# Altium project aqua-pcb.PrjPcb
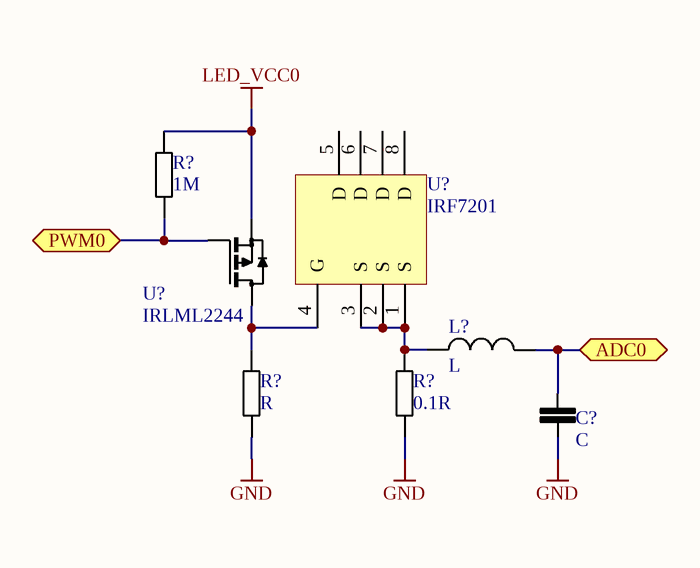
[diagram p0: dimmer.SchDoc]
1 sheet, 7 parts. Net scope: flat (ports and power ports of the same name join across sheets).

## Sheet dimmer.SchDoc
size A4

### Parts
(Parts that share a designator on the sheet are numbered #1, #2 ... from top to bottom, then left to right.)
C?  C  [0805C]
L?  L  [L3030]
R?#1  1M  [0805R]
R?#2  R  [0805R]
R?#3  0.1R  [0805R]
U?#1  IRLML2244
U?#2  IRF7201

### Ports
ADC0, PWM0

### Nets
GND: C?.2 R?#2.1 R?#3.1
LED_VCC0: R?#1.2 U?#1.S
NetC?_1: C?.1 L?.2 ; port ADC0
NetL?_1: L?.1 R?#3.2 U?#2.1(S) U?#2.2(S) U?#2.3(S)
NetR?#1_1: R?#1.1 U?#1.G ; port PWM0
NetR?#2_2: R?#2.2 U?#1.D U?#2.4(G)

Not connected (* = marked no-connect by the designer): U?#2 5(D) 6(D) 7(D) 8(D)

### Library data of the parts
C? = C: Kondensator; Type: Kondensator
L? = L: Cewka; Supplier 1: Farnell; Type: Cewka
R?#1-R?#3 = R: Rezystor; Type: Rezystor